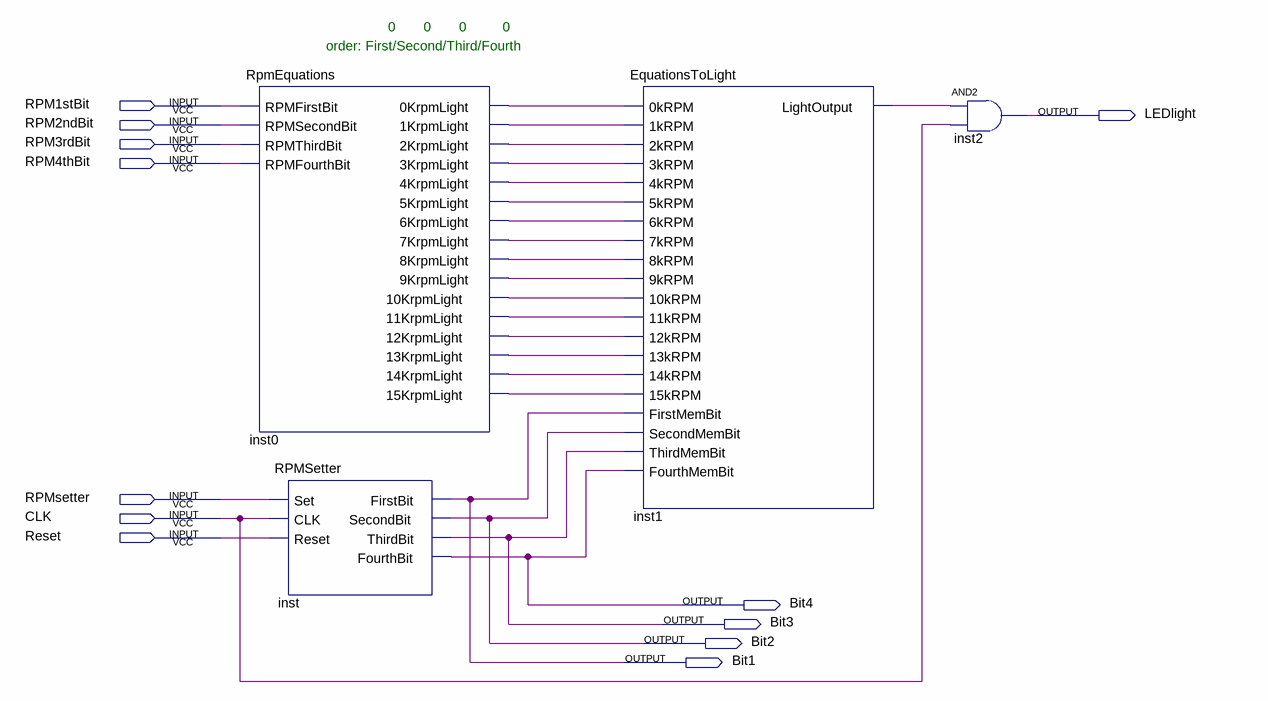
[diagram p0: schematic sheet]
// Quartus schematic ShiftLight.bdf as structural Verilog: 4 symbols, 12 pins
module ShiftLight (
  input  RPM1stBit,
  input  RPM2ndBit,
  input  RPM3rdBit,
  input  RPM4thBit,
  input  RPMsetter,
  input  CLK,
  input  Reset,
  output LEDlight,
  output Bit4,
  output Bit3,
  output Bit2,
  output Bit1
);

  wire inst0_0krpmlight, inst0_1krpmlight, inst0_2krpmlight, inst0_3krpmlight, inst0_4krpmlight,
       inst0_5krpmlight, inst0_6krpmlight, inst0_7krpmlight, inst0_8krpmlight, inst0_9krpmlight,
       inst0_10krpmlight, inst0_11krpmlight, inst0_12krpmlight, inst0_13krpmlight, inst0_14krpmlight,
       inst0_15krpmlight, inst1_lightoutput;

  RpmEquations inst0 (
    .RPMFirstBit(RPM1stBit), .RPMSecondBit(RPM2ndBit), .RPMThirdBit(RPM3rdBit), .RPMFourthBit(RPM4thBit),
    .\0KrpmLight (inst0_0krpmlight), .\1KrpmLight (inst0_1krpmlight), .\2KrpmLight (inst0_2krpmlight),
    .\3KrpmLight (inst0_3krpmlight), .\4KrpmLight (inst0_4krpmlight), .\5KrpmLight (inst0_5krpmlight),
    .\6KrpmLight (inst0_6krpmlight), .\7KrpmLight (inst0_7krpmlight), .\8KrpmLight (inst0_8krpmlight),
    .\9KrpmLight (inst0_9krpmlight), .\10KrpmLight (inst0_10krpmlight), .\11KrpmLight (inst0_11krpmlight),
    .\12KrpmLight (inst0_12krpmlight), .\13KrpmLight (inst0_13krpmlight), .\14KrpmLight (inst0_14krpmlight),
    .\15KrpmLight (inst0_15krpmlight));
  RPMSetter inst (
    .Set(RPMsetter), .CLK(CLK), .Reset(Reset), .FirstBit(Bit1), .SecondBit(Bit2), .ThirdBit(Bit3),
    .FourthBit(Bit4));
  EquationsToLight inst1 (
    .\0kRPM (inst0_0krpmlight), .\1kRPM (inst0_1krpmlight), .\2kRPM (inst0_2krpmlight),
    .\3kRPM (inst0_3krpmlight), .\4kRPM (inst0_4krpmlight), .\5kRPM (inst0_5krpmlight),
    .\6kRPM (inst0_6krpmlight), .\7kRPM (inst0_7krpmlight), .\8kRPM (inst0_8krpmlight),
    .\9kRPM (inst0_9krpmlight), .\10kRPM (inst0_10krpmlight), .\11kRPM (inst0_11krpmlight),
    .\12kRPM (inst0_12krpmlight), .\13kRPM (inst0_13krpmlight), .\14kRPM (inst0_14krpmlight),
    .\15kRPM (inst0_15krpmlight), .FirstMemBit(Bit1), .SecondMemBit(Bit2), .ThirdMemBit(Bit3),
    .FourthMemBit(Bit4), .LightOutput(inst1_lightoutput));
  and inst2 (LEDlight, inst1_lightoutput, CLK);

  // Notes on the sheet:
  //    0       0       0         0    
  //   order: First/Second/Third/Fourth  
endmodule
